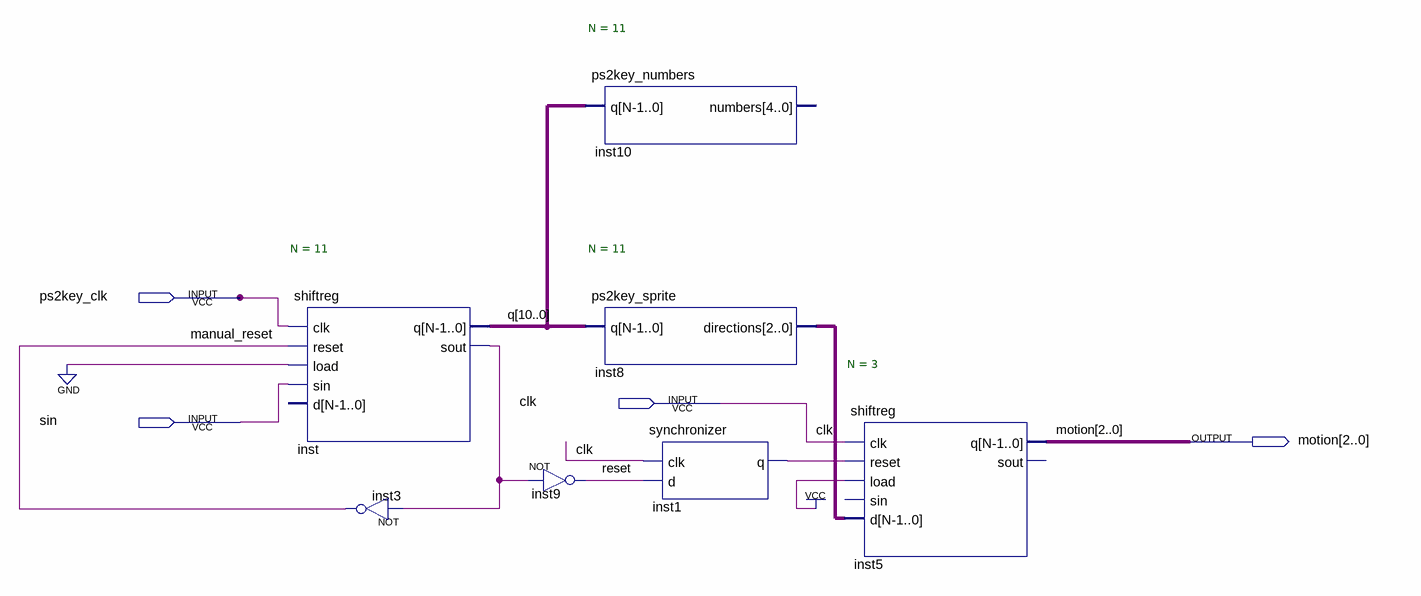
[diagram p0: schematic sheet]
// Quartus schematic simulation_testing.bdf as structural Verilog: 7 symbols, 4 pins
module simulation_testing (
  input  ps2key_clk,
  input  clk,
  input  sin,
  output [2:0] motion
);

  wire inst1_q, inst_sout, manual_reset, reset;
  wire [2:0] inst8_directions;
  wire [10:0] q;

  shiftreg #(.N(11)) inst (
    .clk(ps2key_clk), .reset(manual_reset), .load(1'b0), .sin(sin), .q(q), .sout(inst_sout));  // open: d
  not inst3 (manual_reset, inst_sout);
  not inst9 (reset, inst_sout);
  ps2key_numbers #(.N(11)) inst10 (.q(q));  // open: numbers
  ps2key_sprite #(.N(11)) inst8 (.q(q), .directions(inst8_directions));
  synchronizer inst1 (.clk(clk), .d(reset), .q(inst1_q));
  shiftreg #(.N(3)) inst5 (
    .clk(clk), .reset(inst1_q), .load(1'b1), .d(inst8_directions), .q(motion));  // open: sin, sout
endmodule
